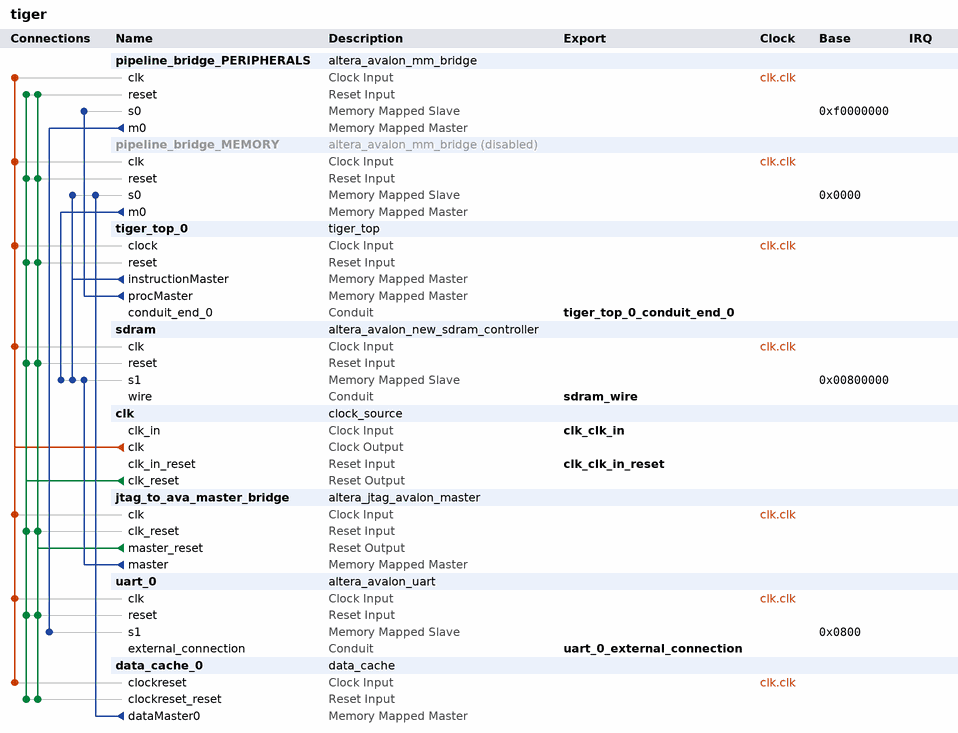
[diagram p0: system contents]
# Platform Designer (Qsys) system tiger, Cyclone II EP2C35F672C6
# Parameters at their usual value, and those the tool derives, are not listed.
package require -exact qsys 13.0
create_system tiger
set_project_property DEVICE_FAMILY {Cyclone II}
set_project_property DEVICE EP2C35F672C6

add_instance pipeline_bridge_PERIPHERALS altera_avalon_mm_bridge 13.0
set_instance_parameter_value pipeline_bridge_PERIPHERALS DATA_WIDTH 32
set_instance_parameter_value pipeline_bridge_PERIPHERALS ADDRESS_WIDTH 12
set_instance_parameter_value pipeline_bridge_PERIPHERALS ADDRESS_UNITS SYMBOLS
set_instance_parameter_value pipeline_bridge_PERIPHERALS MAX_PENDING_RESPONSES 1
set_instance_parameter_value pipeline_bridge_PERIPHERALS PIPELINE_RESPONSE 0

add_instance pipeline_bridge_MEMORY altera_avalon_mm_bridge 13.0
set_instance_property pipeline_bridge_MEMORY ENABLED false
set_instance_parameter_value pipeline_bridge_MEMORY DATA_WIDTH 32
set_instance_parameter_value pipeline_bridge_MEMORY ADDRESS_WIDTH 24
set_instance_parameter_value pipeline_bridge_MEMORY ADDRESS_UNITS SYMBOLS
set_instance_parameter_value pipeline_bridge_MEMORY MAX_BURST_SIZE 64
set_instance_parameter_value pipeline_bridge_MEMORY MAX_PENDING_RESPONSES 10
set_instance_parameter_value pipeline_bridge_MEMORY PIPELINE_RESPONSE 0

add_instance tiger_top_0 tiger_top 1.0
set_instance_parameter_value tiger_top_0 prof_param_N2 8
set_instance_parameter_value tiger_top_0 prof_param_S2 5
set_instance_parameter_value tiger_top_0 prof_param_CW 32

add_instance sdram altera_avalon_new_sdram_controller 13.0.1
set_instance_parameter_value sdram TAC 5.5
set_instance_parameter_value sdram TRCD 20.0
set_instance_parameter_value sdram TRP 20.0
set_instance_parameter_value sdram casLatency 3
set_instance_parameter_value sdram columnWidth 8
set_instance_parameter_value sdram dataWidth 16
set_instance_parameter_value sdram generateSimulationModel true
set_instance_parameter_value sdram model custom
set_instance_parameter_value sdram numberOfBanks 4
set_instance_parameter_value sdram numberOfChipSelects 1
set_instance_parameter_value sdram powerUpDelay 100.0
set_instance_parameter_value sdram refreshPeriod 15.625
set_instance_parameter_value sdram rowWidth 12

add_instance clk clock_source 13.0
set_instance_parameter_value clk clockFrequency 200000000

add_instance jtag_to_ava_master_bridge altera_jtag_avalon_master 13.0

add_instance uart_0 altera_avalon_uart 13.0.1
set_instance_parameter_value uart_0 baud 115200
set_instance_parameter_value uart_0 dataBits 8
set_instance_parameter_value uart_0 fixedBaud true
set_instance_parameter_value uart_0 parity NONE
set_instance_parameter_value uart_0 stopBits 1

add_instance data_cache_0 data_cache 1.0

# connections
add_connection clk.clk data_cache_0.clockreset clock
add_connection clk.clk jtag_to_ava_master_bridge.clk clock
add_connection clk.clk pipeline_bridge_MEMORY.clk clock
add_connection clk.clk pipeline_bridge_PERIPHERALS.clk clock
add_connection clk.clk sdram.clk clock
add_connection clk.clk tiger_top_0.clock clock
add_connection clk.clk uart_0.clk clock
add_connection clk.clk_reset data_cache_0.clockreset_reset reset
add_connection clk.clk_reset jtag_to_ava_master_bridge.clk_reset reset
add_connection clk.clk_reset pipeline_bridge_MEMORY.reset reset
add_connection clk.clk_reset pipeline_bridge_PERIPHERALS.reset reset
add_connection clk.clk_reset sdram.reset reset
add_connection clk.clk_reset tiger_top_0.reset reset
add_connection clk.clk_reset uart_0.reset reset
add_connection jtag_to_ava_master_bridge.master_reset data_cache_0.clockreset_reset reset
add_connection jtag_to_ava_master_bridge.master_reset jtag_to_ava_master_bridge.clk_reset reset
add_connection jtag_to_ava_master_bridge.master_reset pipeline_bridge_MEMORY.reset reset
add_connection jtag_to_ava_master_bridge.master_reset pipeline_bridge_PERIPHERALS.reset reset
add_connection jtag_to_ava_master_bridge.master_reset sdram.reset reset
add_connection jtag_to_ava_master_bridge.master_reset tiger_top_0.reset reset
add_connection jtag_to_ava_master_bridge.master_reset uart_0.reset reset
add_connection data_cache_0.dataMaster0 pipeline_bridge_MEMORY.s0 avalon
set_connection_parameter_value data_cache_0.dataMaster0/pipeline_bridge_MEMORY.s0 baseAddress 0x0000
add_connection jtag_to_ava_master_bridge.master sdram.s1 avalon
set_connection_parameter_value jtag_to_ava_master_bridge.master/sdram.s1 baseAddress 0x00800000
add_connection pipeline_bridge_MEMORY.m0 sdram.s1 avalon
set_connection_parameter_value pipeline_bridge_MEMORY.m0/sdram.s1 baseAddress 0x00800000
add_connection pipeline_bridge_PERIPHERALS.m0 uart_0.s1 avalon
set_connection_parameter_value pipeline_bridge_PERIPHERALS.m0/uart_0.s1 baseAddress 0x0800
add_connection tiger_top_0.instructionMaster pipeline_bridge_MEMORY.s0 avalon
set_connection_parameter_value tiger_top_0.instructionMaster/pipeline_bridge_MEMORY.s0 baseAddress 0x0000
add_connection tiger_top_0.instructionMaster sdram.s1 avalon
set_connection_parameter_value tiger_top_0.instructionMaster/sdram.s1 baseAddress 0x00800000
add_connection tiger_top_0.procMaster pipeline_bridge_PERIPHERALS.s0 avalon
set_connection_parameter_value tiger_top_0.procMaster/pipeline_bridge_PERIPHERALS.s0 baseAddress 0xf0000000

# exported interfaces
add_interface clk_clk_in_reset reset sink
set_interface_property clk_clk_in_reset EXPORT_OF clk.clk_in_reset
add_interface sdram_wire conduit end
set_interface_property sdram_wire EXPORT_OF sdram.wire
add_interface clk_clk_in clock sink
set_interface_property clk_clk_in EXPORT_OF clk.clk_in
add_interface uart_0_external_connection conduit end
set_interface_property uart_0_external_connection EXPORT_OF uart_0.external_connection
add_interface tiger_top_0_conduit_end_0 conduit end
set_interface_property tiger_top_0_conduit_end_0 EXPORT_OF tiger_top_0.conduit_end_0

set_interconnect_requirement {$system} qsys_mm.clockCrossingAdapter HANDSHAKE
set_interconnect_requirement {$system} qsys_mm.maxAdditionalLatency 0

save_system tiger.qsys
